# Altium schematic sheet Sheet1.SchDoc
size A3
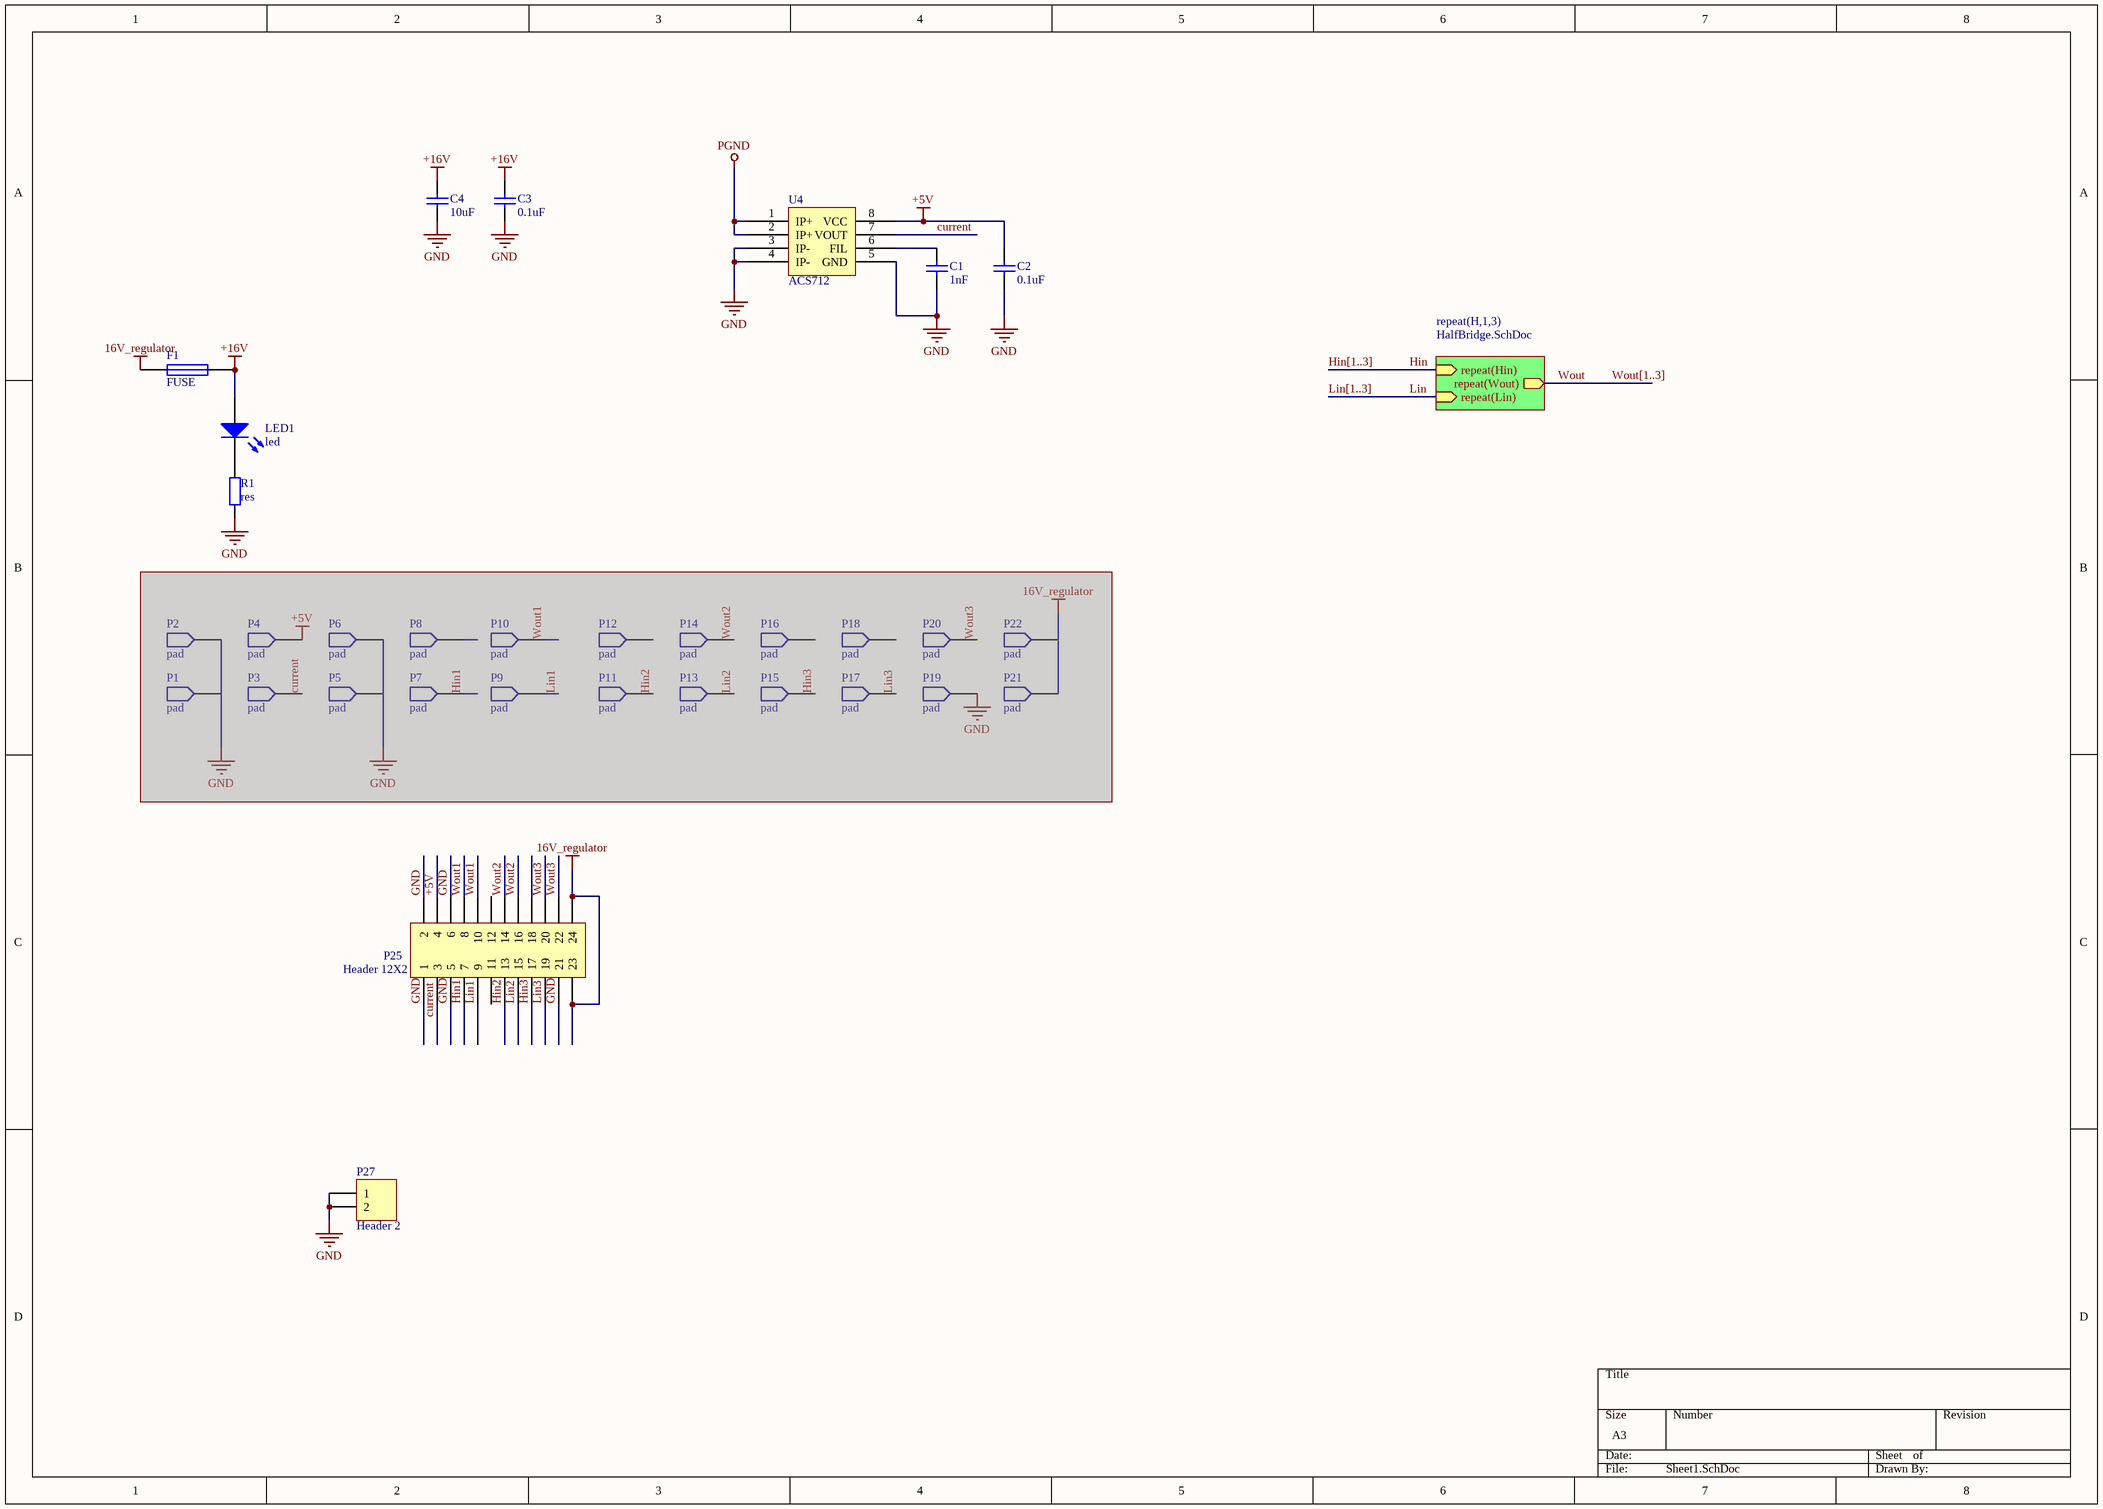
[diagram p0: Sheet1.SchDoc]

## Parts
C1  1nF  [0603]
C2  0.1uF  [0603]
C3  0.1uF  [0603]
C4  10uF  [0603]
F1  FUSE  [FUSE]
LED1  led  [0603_diode]
P1  pad  [pad-blank]  (masked out: inside a compile mask, not in the netlist)
P2  pad  [pad-blank]  (masked out: inside a compile mask, not in the netlist)
P3  pad  [pad-blank]  (masked out: inside a compile mask, not in the netlist)
P4  pad  [pad-blank]  (masked out: inside a compile mask, not in the netlist)
P5  pad  [pad-blank]  (masked out: inside a compile mask, not in the netlist)
P6  pad  [pad-blank]  (masked out: inside a compile mask, not in the netlist)
P7  pad  [pad-blank]  (masked out: inside a compile mask, not in the netlist)
P8  pad  [pad-blank]  (masked out: inside a compile mask, not in the netlist)
P9  pad  [pad-blank]  (masked out: inside a compile mask, not in the netlist)
P10  pad  [pad-blank]  (masked out: inside a compile mask, not in the netlist)
P11  pad  [pad-blank]  (masked out: inside a compile mask, not in the netlist)
P12  pad  [pad-blank]  (masked out: inside a compile mask, not in the netlist)
P13  pad  [pad-blank]  (masked out: inside a compile mask, not in the netlist)
P14  pad  [pad-blank]  (masked out: inside a compile mask, not in the netlist)
P15  pad  [pad-blank]  (masked out: inside a compile mask, not in the netlist)
P16  pad  [pad-blank]  (masked out: inside a compile mask, not in the netlist)
P17  pad  [pad-blank]  (masked out: inside a compile mask, not in the netlist)
P18  pad  [pad-blank]  (masked out: inside a compile mask, not in the netlist)
P19  pad  [pad-blank]  (masked out: inside a compile mask, not in the netlist)
P20  pad  [pad-blank]  (masked out: inside a compile mask, not in the netlist)
P21  pad  [pad-blank]  (masked out: inside a compile mask, not in the netlist)
P22  pad  [pad-blank]  (masked out: inside a compile mask, not in the netlist)
P25  Header 12X2  [HDR2X12]
P27  Header 2  [HDR1X2]
R1  res  [0603]
U4  ACS712  [SOIC-8]

## Sub-sheets
repeat(H,1,3) = HalfBridge.SchDoc: repeat(Wout) (out), repeat(Hin) (in), repeat(Lin) (in)

## Nets
16V_regulator: F1.1 P25.23 P25.24
+5V: C2.2 P25.4 U4.8(VCC)
+16V: C3.2 C4.2 F1.2 LED1.1(A)
GND: C1.1 C2.1 C3.1 C4.1 P25.1 P25.2 P25.5 P25.6 P25.21 P27.1 P27.2 R1.1 U4.3(IP-) U4.4(IP-) U4.5(GND)
PGND: U4.1(IP+) U4.2(IP+)
current: P25.3 U4.7(VOUT)
Hin: sheet repeat(H,1,3)/repeat(Hin)
Hin1: P25.7
Hin2: P25.13
Hin3: P25.17
Lin: sheet repeat(H,1,3)/repeat(Lin)
Lin1: P25.9
Lin2: P25.15
Lin3: P25.19
Wout: sheet repeat(H,1,3)/repeat(Wout)
Wout1: P25.8 P25.10
Wout2: P25.14 P25.16
Wout3: P25.20 P25.22
NetC1_2: C1.2 U4.6(FIL)
NetLED1_2: LED1.2(K) R1.2

Not connected (* = marked no-connect by the designer): P25 11 12 18

## Buses and harness runs
bus Hin[1..3]
bus Lin[1..3]
bus Wout[1..3]

## Library data of the parts
C1-C4 = cap
P25 = Header 12X2: Header, 12-Pin, Dual row; LatestRevisionDate: 17-Jul-2002; LatestRevisionNote: Re-released for DXP Platform.; Publisher: Altium Limited
P27 = Header 2: Header, 2-Pin; LatestRevisionDate: 17-Jul-2002; LatestRevisionNote: Re-released for DXP Platform.; Publisher: Altium Limited